# EAGLE design relay_shield2 (EAGLE 7.7.0)
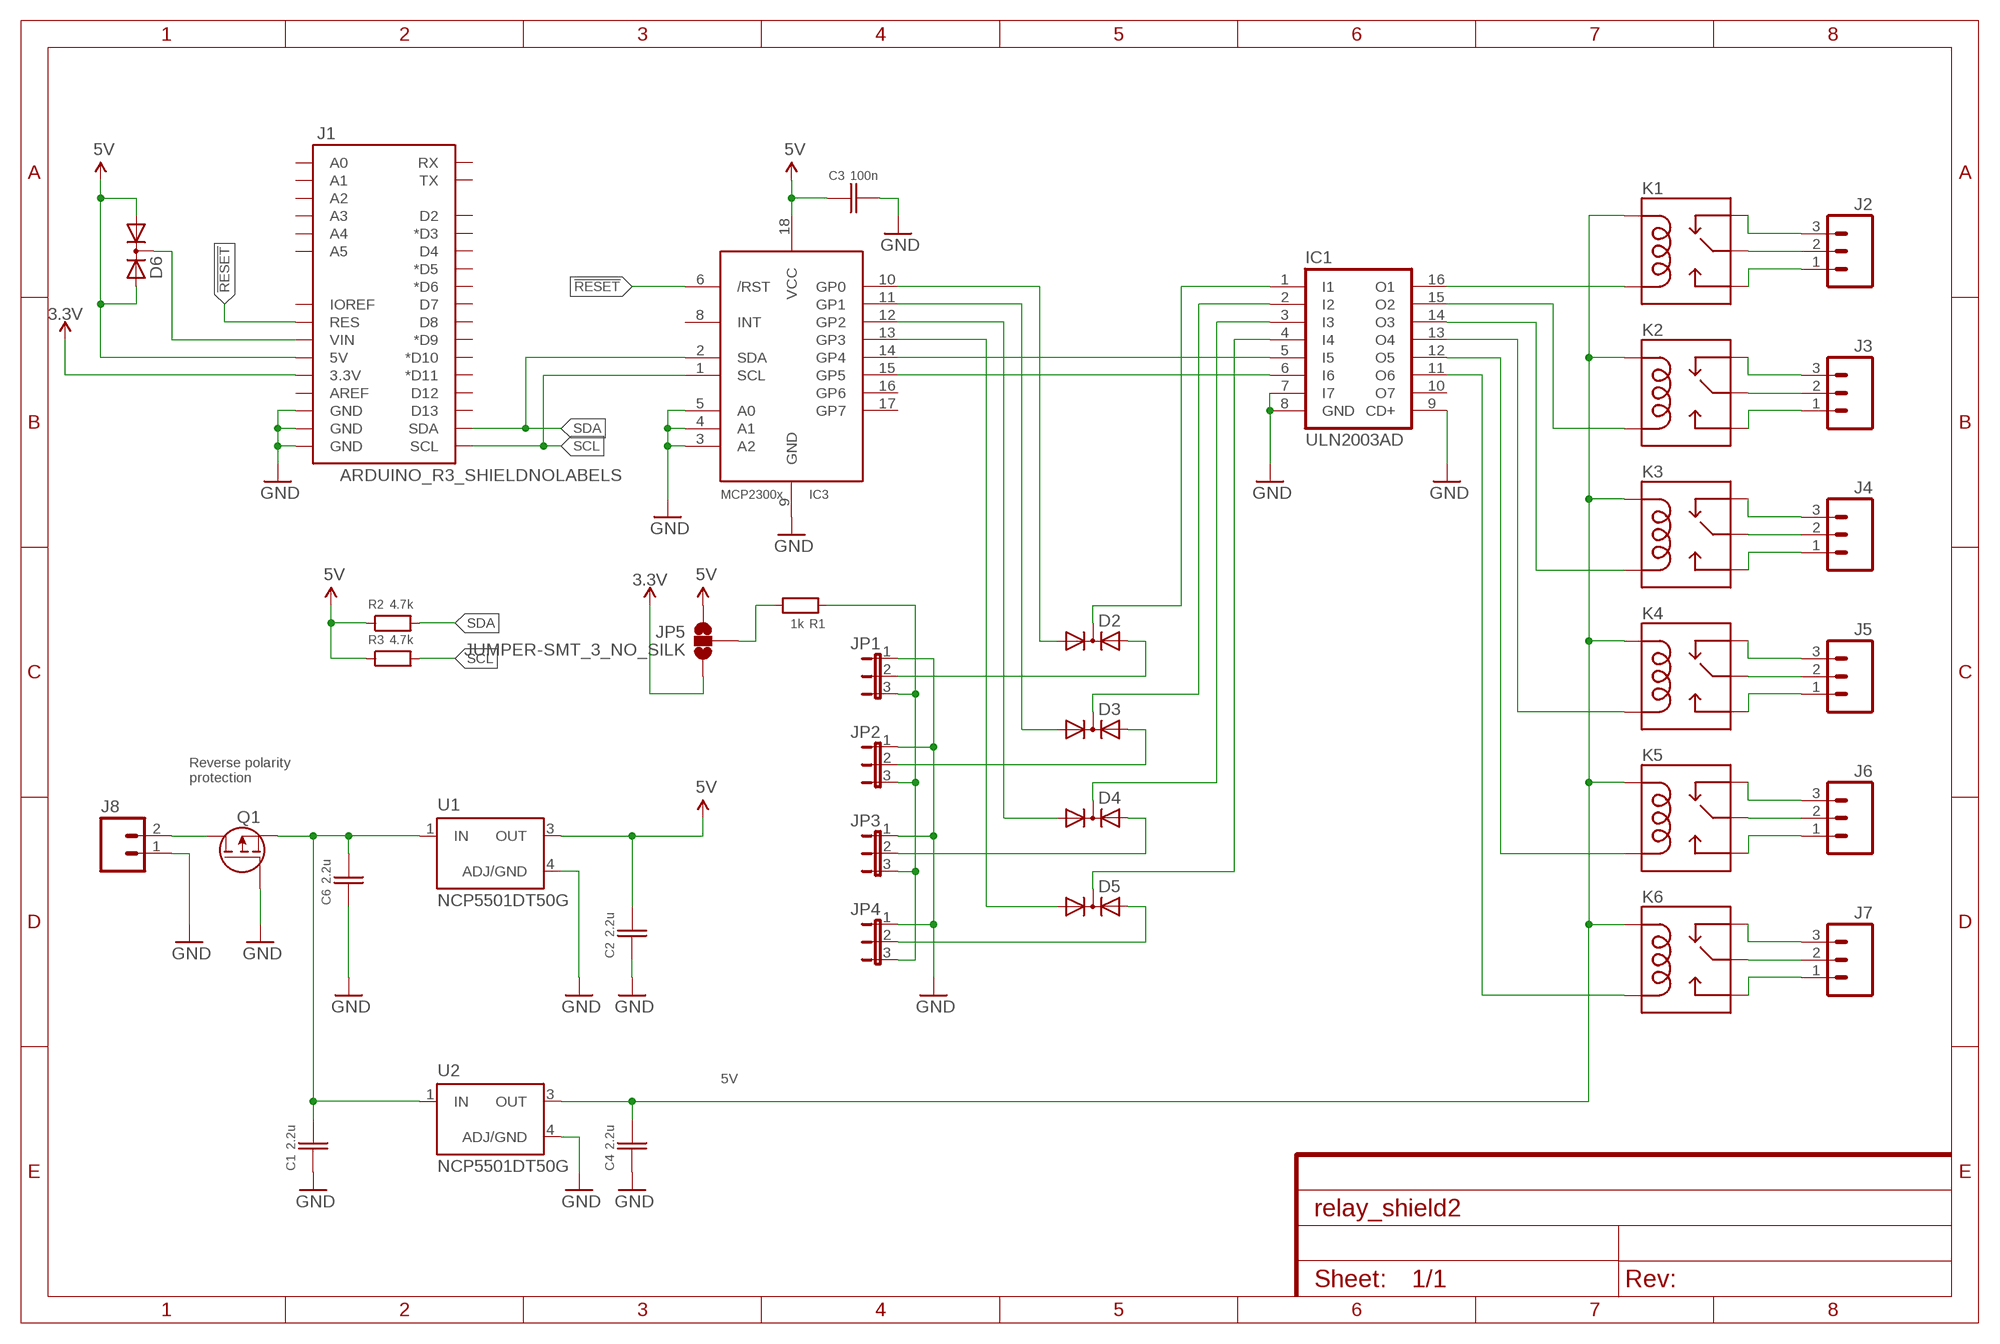
[diagram p0: schematic, sheet 1]

## Parts
C1  2.2u  CAPACITOR_NPOL-1206  [C1206]
C2  2.2u  CAPACITOR_NPOL-1206  [C1206]
C3  100n  CAPACITOR_NPOL-0603  [C603]
C4  2.2u  CAPACITOR_NPOL-1206  [C1206]
C6  2.2u  CAPACITOR_NPOL-1206  [C1206]
D2  DIODE-2AC|CASOT23  [SOT23]
D3  DIODE-2AC|CASOT23  [SOT23]
D4  DIODE-2AC|CASOT23  [SOT23]
D5  DIODE-2AC|CASOT23  [SOT23]
D6  DIODE-2AC|CASOT23  [SOT23]
IC1  ULN2003AD  [SO16]
IC3  MCP23008/SO  [SO18W]
J1  ARDUINO_R3_SHIELDNOLABELS  [UNO_R3_SHIELD_NOLABELS]
J2  M03SCREW  [SCREWTERMINAL-3.5MM-3]
J3  M03SCREW  [SCREWTERMINAL-3.5MM-3]
J4  M03SCREW  [SCREWTERMINAL-3.5MM-3]
J5  M03SCREW  [SCREWTERMINAL-3.5MM-3]
J6  M03SCREW  [SCREWTERMINAL-3.5MM-3]
J7  M03SCREW  [SCREWTERMINAL-3.5MM-3]
J8  M023.5MM  [SCREWTERMINAL-3.5MM-2]
JP1  JP2E  [JP2]
JP2  JP2E  [JP2]
JP3  JP2E  [JP2]
JP4  JP2E  [JP2]
JP5  JUMPER-SMT_3_NO_SILK  [SMT-JUMPER_3_NO_SILK]
K1  RELAY-SPDTPTH6  [RELAY-SCHRACK-RY211]
K2  RELAY-SPDTPTH6  [RELAY-SCHRACK-RY211]
K3  RELAY-SPDTPTH6  [RELAY-SCHRACK-RY211]
K4  RELAY-SPDTPTH6  [RELAY-SCHRACK-RY211]
K5  RELAY-SPDTPTH6  [RELAY-SCHRACK-RY211]
K6  RELAY-SPDTPTH6  [RELAY-SCHRACK-RY211]
Q1  MOSFET-P-SOT23-3  [SOT23-3]
R1  1k  RESISTOR-0603  [R0603]
R2  4.7k  RESISTOR-0603  [R0603]
R3  4.7k  RESISTOR-0603  [R0603]
U1  NCP5501DT50G  VREG-3PIN-DPAK  [DPAK]
U2  NCP5501DT50G  VREG-3PIN-DPAK  [DPAK]

## Nets
3.3V: J1.3.3V JP5.3
5V: C2.2 C3.1 D6.1(A1) D6.2(A2) IC3.18(VCC) J1.5V JP5.1 R2.1 R3.1 U1.3(OUT)
!RESET: IC3.6(/RST) J1.RES
GND: C1.1 C2.1 C3.2 C4.1 C6.1 IC1.7(I7) IC1.8(GND) IC1.9(CD+) IC3.3(A2) IC3.4(A1) IC3.5(A0) IC3.9(GND) J1.GND@0(GND) J1.GND@1(GND) J1.GND@2(GND) J8.1 JP1.1 JP2.1 JP3.1 JP4.1 Q1.1(G) U2.4(ADJ/GND)
N$1: D2.2(A2) JP1.2
N$2: D3.2(A2) JP2.2
N$3: J2.2 K1.11(MAIN)
N$4: C1.2 C6.2 Q1.2(S) U1.1(IN) U2.1(IN)
N$6: C4.2 K1.A1(COIL1) K2.A1(COIL1) K3.A1(COIL1) K4.A1(COIL1) K5.A1(COIL1) K6.A1(COIL1) U2.3(OUT)
N$7: J3.2 K2.11(MAIN)
N$8: J4.2 K3.11(MAIN)
N$9: J5.2 K4.11(MAIN)
N$10: J6.2 K5.11(MAIN)
N$11: J7.2 K6.11(MAIN)
N$12: IC1.16(O1) K1.A2(COIL2)
N$13: IC1.15(O2) K2.A2(COIL2)
N$14: IC1.14(O3) K3.A2(COIL2)
N$15: IC1.13(O4) K4.A2(COIL2)
N$16: IC1.12(O5) K5.A2(COIL2)
N$17: IC1.11(O6) K6.A2(COIL2)
N$18: D2.3(C) IC1.1(I1)
N$19: D3.3(C) IC1.2(I2)
N$20: D4.3(C) IC1.3(I3)
N$21: D5.3(C) IC1.4(I4)
N$22: IC1.5(I5) IC3.14(GP4)
N$23: IC1.6(I6) IC3.15(GP5)
N$24: D6.3(C) J1.VIN
N$25: D4.2(A2) JP3.2
N$26: D5.2(A2) JP4.2
N$27: D2.1(A1) IC3.10(GP0)
N$28: D3.1(A1) IC3.11(GP1)
N$29: D4.1(A1) IC3.12(GP2)
N$30: D5.1(A1) IC3.13(GP3)
N$31: J8.2 Q1.3(D)
N$32: J2.3 K1.12(NC)
N$33: J2.1 K1.14(NO)
N$34: J3.3 K2.12(NC)
N$35: J3.1 K2.14(NO)
N$36: J4.3 K3.12(NC)
N$37: J4.1 K3.14(NO)
N$38: J5.3 K4.12(NC)
N$39: J5.1 K4.14(NO)
N$40: J6.3 K5.12(NC)
N$41: J6.1 K5.14(NO)
N$42: J7.3 K6.12(NC)
N$43: J7.1 K6.14(NO)
N$44: JP1.3 JP2.3 JP3.3 JP4.3 R1.1
N$47: JP5.2 R1.2
SCL: IC3.1(SCL) J1.SCL R3.2
SDA: IC3.2(SDA) J1.SDA R2.2
Unconnected: IC1.10(O7) IC3.8(INT) IC3.16(GP6) IC3.17(GP7) J1.A0 J1.A1 J1.A2 J1.A3 J1.A4 J1.A5 J1.AREF J1.D2 J1.D3(*D3) J1.D4 J1.D5(*D5) J1.D6(*D6) J1.D7 J1.D8 J1.D9(*D9) J1.D10(*D10) J1.D11(*D11) J1.D12 J1.D13 J1.IOREF J1.RX J1.TX U1.4(ADJ/GND)

## Notes on the sheet
- Reverse polarity
  protection
- 5V

## Library data of the parts
C1-C4 C6 = kg-generic:CAPACITOR_NPOL: Non-Polarized capacitor in various packages
D2-D6 = diode:DIODE-2AC|CA: Dual DIODE Anode-Cathode|Cathode-Anode
IC1 = uln-udn:ULN2003A: DRIVER ARRAY
IC3 = adafruit:MCP23008: MCP23008 Inexpensive i2c i/o expander - 8 general purpose i/o pins with optional pullups
J1 = SparkFun-Boards:ARDUINO_R3_SHIELD: Shield form compatible with the Arduino Uno R3.
J2-J7 = SparkFun-Connectors:M03: Header 3 Standard 3-pin 0.1" header. Use with straight break away headers (SKU : PRT-00116), right angle break away headers (PRT-00553), swiss pins (PRT-00743), machine pins (PRT-00117), and female headers (PRT-00115). Molex polarized connector foot print use with SKU : PRT-08232 with associated crimp pins and housings.; PROD_ID: CONN-08288
J8 = SparkFun-Connectors:M02: Standard 2-pin 0.1" header. Use with - straight break away headers ( PRT-00116) - right angle break away headers (PRT-00553) - swiss pins (PRT-00743) - machine pins (PRT-00117) - female headers (PRT-00115) Molex polarized connector foot print use with: PRT-08233 with associated crimp pins and housings. 2.54_SCREWTERM for use with PRT-10571. 3.5mm Screw Terminal footprints for PRT-08084 5mm Screw Terminal footprints for use with PRT-08432; PROD_ID: CONN-08399
JP1-JP4 = jumper:JP2E: JUMPER
JP5 = SparkFun-Jumpers:JUMPER-SMT_3_NO: Normally open jumper This jumper has three pads in close proximity to each other. Apply solder to close the connection(s).
K1-K6 = kg-relays:RELAY-SPDT: SPDT relay (COM-00101)
Q1 = kg-generic:MOSFET-P: Generic P-MOSFET IRF7406 SO8 30V 5.8A 45mOhm IRLML6401 SOT23-3 12V 4.3A 50mOhm IRLML6402 SOT23-3 20V 3.7A 65mOhm
R1-R3 = kg-generic:RESISTOR: Generic resistor
U1 U2 = kg-generic:VREG-3PIN: Generic 3-pin linear voltage regulator

## Board
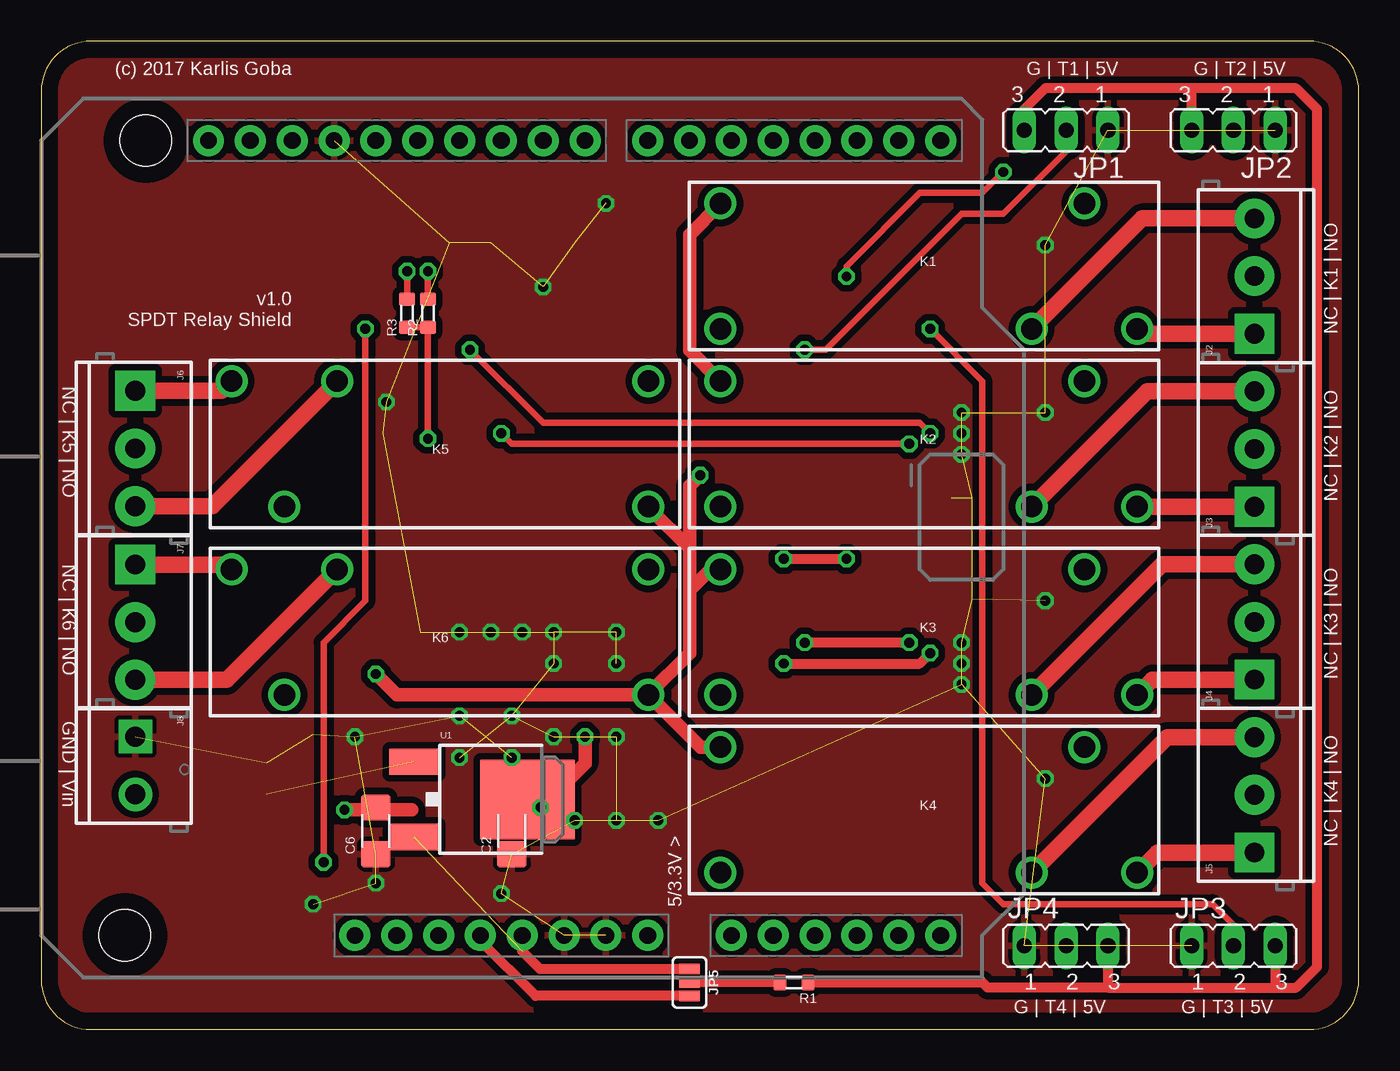
[diagram p1: board, top side]
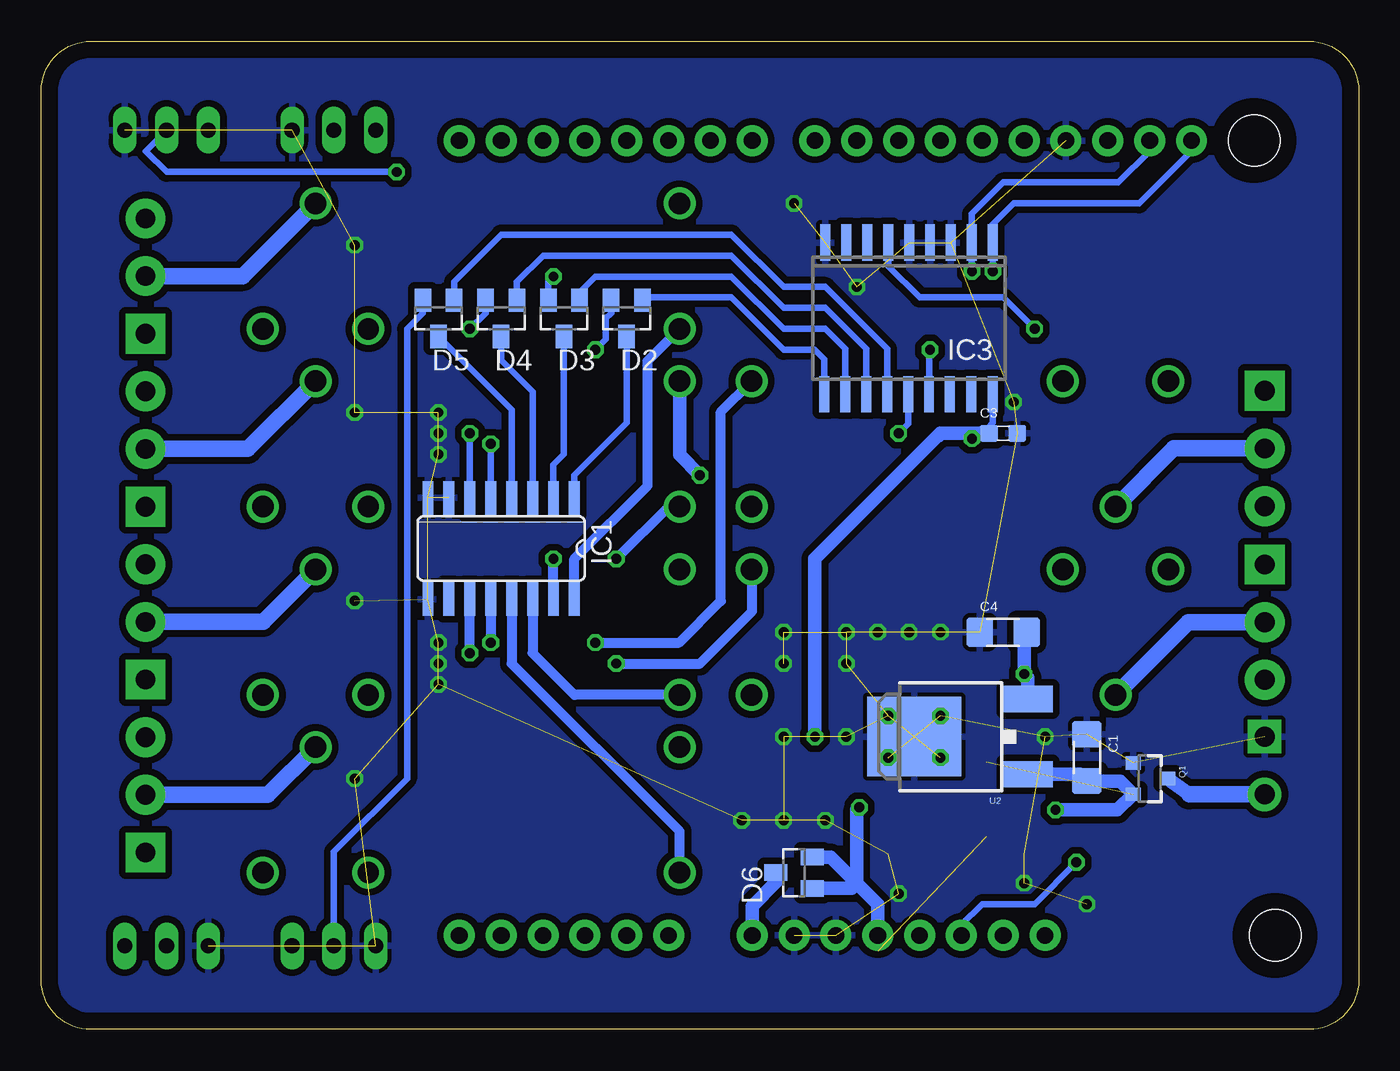
[diagram p2: board, bottom side, seen from below]

Size 80 x 60 mm. Coordinates in mm from the lower left corner, seen from the top.
Outline: 0,57 0,3 arc90 3,0 77,0 arc90 80,3 80,57 arc90 77,60 3,60 arc90 0,57
Copper layers (1*16): Top 0.035mm / dielectric 1.5mm / Bottom 0.035mm
Design rules "default": minimum track width 10mil, minimum drill 24mil, track to track 8mil, track to pad 8mil, pad to pad 8mil, via to via 8mil, smd to smd 8mil, copper to edge 40mil, drill to drill 8mil, minimum pad ring 10mil, minimum via ring 8mil, stop-mask expansion 4mil, vias tented up to drill 0mil, thermal gap 10mil
Holes 3.1 mm at 5.08,5.71 6.35,53.98

### Footprints (pad centres in the part's own frame; a part is rotated, then mirrored left to right if it is on the bottom)
C1206 = smd 1.6 x 1.803: 1 -1.422,0; 2 1.422,0
C603 = smd 1.1 x 1: 1 -0.85,0; 2 0.85,0
SOT23 = smd 1 x 1.4: 1 -0.95,-1.1; 2 0.95,-1.1; 3 0,1.1
SO16 = smd 0.66 x 2.032: 1 -4.445,-3.073; 2 -3.175,-3.073; 3 -1.905,-3.073; 4 -0.635,-3.073; 5 0.635,-3.073; 6 1.905,-3.073; 7 3.175,-3.073; 8 4.445,-3.073; 9 4.445,3.073; 10 3.175,3.073; 11 1.905,3.073; 12 0.635,3.073; 13 -0.635,3.073; 14 -1.905,3.073; 15 -3.175,3.073; 16 -4.445,3.073
SO18W = smd 0.6 x 2.2: 1 -4.445,-4.6; 2 -3.175,-4.6; 3 -1.905,-4.6; 4 -0.635,-4.6; 5 0.635,-4.6; 6 1.905,-4.6; 7 3.175,-4.6; 8 4.445,-4.6; 9 5.715,-4.6; 10 5.775,4.6; 11 4.505,4.6; 12 3.235,4.6; 13 1.965,4.6; 14 0.695,4.6; 15 -0.575,4.6; 16 -1.845,4.6; 17 -3.145,4.6; 18 -4.445,4.6
UNO_R3_SHIELD_NOLABELS = drill 1.016 pad 1.88: 3.3V 50.8,26.67; 5V 50.8,29.21; A0 50.8,41.91; A1 50.8,44.45; A2 50.8,46.99; A3 50.8,49.53; A4 50.8,52.07; A5 50.8,54.61; AREF 2.54,15.24; D2 2.54,49.53; D3 2.54,46.99; D4 2.54,44.45; D5 2.54,41.91; D6 2.54,39.37; D7 2.54,36.83; D8 2.54,33.02; D9 2.54,30.48; D10 2.54,27.94; D11 2.54,25.4; D12 2.54,22.86; D13 2.54,20.32; GND@0 50.8,31.75; GND@1 50.8,34.29; GND@2 2.54,17.78; IOREF 50.8,21.59; NC 50.8,19.05; RES 50.8,24.13; RX 2.54,54.61; SCL 2.54,10.16; SDA 2.54,12.7; TX 2.54,52.07; VIN 50.8,36.83
SCREWTERMINAL-3.5MM-3 = drill 1.2 pad 2.413 square: 1 0,0 | drill 1.2 pad 2.413: 2 3.5,0; 3 7,0
SCREWTERMINAL-3.5MM-2 = drill 1.2 pad 2.032 square: 1 0,0 | drill 1.2 pad 2.032: 2 3.5,0
JP2 = drill 0.914 long: 1 -2.54,0; 2 0,0; 3 2.54,0
SMT-JUMPER_3_NO_SILK = smd 0.635 x 1.27: 1 -0.813,0; 2 0,0; 3 0.813,0
RELAY-SCHRACK-RY211 = drill 1.3: 11 10,3.81; 12 6.8,-3.81; 14 13.2,-3.81; A1 -12.1,3.81; A2 -12.1,-3.81
SOT23-3 = smd 0.8 x 0.9: 1 -0.95,-1; 2 0.95,-1; 3 0,1.1
R0603 = smd 0.8 x 0.95: 1 -0.85,0; 2 0.85,0
DPAK = smd 1.6 x 3: 1 -2.28,-5.31; 3 2.28,-5.31 | smd 4.826 x 5.715: 4 0,1.588

### Placement (x,y rotation side)
C1  16.51,16.5 270 bottom
C2  28.57,12.05 90 top
C3  21.59,36.19 0 bottom
C4  21.59,24.12 0 bottom
C6  20.32,12.05 90 top
D2  44.45,43.17 180 bottom
D3  48.26,43.17 180 bottom
D4  52.07,43.17 180 bottom
D5  55.88,43.17 180 bottom
D6  34.29,9.52 90 bottom
IC1  52.07,29.2 180 bottom
IC3  26.67,43.17 180 bottom
J1  0,56.51 270 top
J2  73.66,42.24 90 top
J3  73.66,31.74 90 top
J4  73.66,21.24 90 top
J5  73.66,10.74 90 top
J6  5.71,38.77 270 top
J7  5.71,28.23 270 top
J8  5.71,17.77 270 top
JP1  62.23,54.6 180 top
JP2  72.39,54.6 180 top
JP3  72.39,5.07 0 top
JP4  62.23,5.07 0 top
JP5  39.36,2.85 270 top
K1  53.34,46.34 0 top
K2  53.34,35.55 0 top
K3  53.34,24.12 0 top
K4  53.34,13.32 0 top
K5  24.77,35.55 180 top
K6  24.77,24.12 180 top
Q1  12.7,15.23 270 bottom
R1  45.71,2.85 180 top
R2  23.48,43.49 90 top
R3  22.21,43.49 90 top
U1  27.94,13.97 270 top
U2  25.4,17.77 90 bottom

### Tracks (layer width: path | path; a pad name or v marks a point on that pad's centre or on a via)
3.3V  (via drill 0.6)
  Top 0.61: JP5.3 30.01,2.04 26.66,5.39 v26.66,5.7
  Bottom 0.406: v26.66,5.7 J1.3.3V
5V  (via drill 0.6)  (1 unrouted)
  Top 0.406: v23.48,35.87 R2.1 R3.1
  Top 0.61: 28.41,13.01 C2.2 | JP5.1 30.29,3.66 29.2,4.75 v29.2,5.7
  Top 0.813: v33.02,17.77 33.02,16.17 v30.33,13.48 C2.2
  Bottom 0.406: IC3.18 22.23,36.82 22.54,36.5 | 22.54,36.5 22.86,36.19 23.17,36.19 v23.48,35.87 | C3.1 22.44,36.4 22.54,36.5 | 25.4,36.19 25.4,35.88 25.39,35.87 | v29.2,5.7 J1.5V
  Bottom 0.813: 22.86,36.19 25.4,36.19 33.02,28.57 v33.02,17.77 | J1.5V 29.21,7.61 30.48,8.88 | 30.48,8.88 30.48,13.32 v30.33,13.48 | D6.1 30.8,8.56 30.48,8.88 | D6.2 32.06,10.46 30.48,8.88
!RESET  (via drill 0.6)
  Top 0.406: v19.68,42.53 19.68,26.02 17.14,23.48 v17.14,10.15
  Bottom 0.406: IC3.6 28.57,46.34 26.67,44.44 21.59,44.44 v19.68,42.53 | v17.14,10.15 19.68,7.61 22.86,7.61 24.13,6.34 J1.RES
GND  (via drill 0.6)  (54 unrouted)
  other vias: 20.32,8.88 32.38,12.69 27.94,8.24 19.05,17.77 25.4,24.12 31.11,17.77 31.11,24.12 29.21,24.12 31.11,22.21 27.3,24.12 30.48,45.08 20.95,38.09 55.88,23.48 55.88,34.91 60.96,15.23 60.96,26.02 60.96,37.45 60.96,47.62 34.29,50.16 16.51,7.61 55.88,36.19 55.88,22.21 55.88,20.95 55.88,37.45 28.57,16.5 28.57,19.04 25.4,19.04 25.4,16.5 34.92,12.69 37.47,12.69 34.92,22.21 34.92,24.12 34.92,17.77
  pour Bottom (isolate 0.406): 82.55,63.3 82.55,-3.17 -2.54,-3.17 -2.54,63.3
  pour Top (isolate 0.406): 83.82,64.57 83.82,-4.44 -3.81,-4.44 -3.81,64.57
N$1  (via drill 0.6)
  Top 0.406: v46.35,41.27 47.62,41.27 55.88,49.52 58.42,49.52 62.23,53.33 JP1.2
  Bottom 0.406: D2.2 45.4,43.49 45.72,43.17 45.72,41.9 v46.35,41.27
N$2  (via drill 0.6)
  Top 0.406: v48.9,45.71 48.9,46.34 53.34,50.79 57.15,50.79 v58.42,52.06
  Bottom 0.406: D3.2 49.21,45.4 v48.9,45.71 | v58.42,52.06 72.39,52.06 73.66,53.33 JP2.2
N$3
  Bottom 1.016: J2.2 67.75,45.74 K1.11
N$4  (via drill 0.6)  (1 unrouted)
  Top 0.61: C6.2 20.32,13.32
  Top 0.813: v18.41,13.32 20.32,13.32 22.5,13.32
  Bottom 0.813: v18.41,13.32 14.65,13.32 Q1.2 14.5,15.08 C1.2 16.92,15.49 U2.1
  Bottom 1.27: 16.59,15 C1.2
N$6  (via drill 0.6)
  Top 0.406: K1.A1 41.24,50.12 | K5.A1 36.87,31.7 | K6.A1 36.87,20.34
  Top 0.813: 41.24,50.12 39.37,48.25 39.37,41.23 K2.A1 | 39.37,29.2 39.37,26.66 | 36.87,31.7 39.37,29.2 | K3.A1 40.64,27.93 39.37,26.66 | 36.87,20.34 39.37,22.85 39.37,26.66 | K4.A1 40.04,17.14 K6.A1 21.59,20.31 v20.32,21.58 | 39.37,29.2 39.37,33.01 v40.01,33.65
  Bottom 0.406: 20.09,21.35 v20.32,21.58 | 20.32,23.97 C4.2
  Bottom 0.813: K2.A1 41.24,34.88 v40.01,33.65 | U2.3 20.09,21.35 | v20.32,21.58 20.32,23.97
N$7
  Bottom 1.016: J3.2 67.46,35.24 K2.11
N$8
  Bottom 1.016: J4.2 66.53,24.74 K3.11
N$9
  Bottom 1.016: J5.2 66.23,14.24 K4.11
N$10
  Bottom 1.016: J6.2 11.23,35.27 K5.11
N$11
  Bottom 1.016: J7.2 10.35,24.73 K6.11
N$12
  Bottom 0.61: IC1.16 47.62,28.57 43.18,33.01 43.18,40.59 K1.A2
N$13  (via drill 0.6)
  Top 0.61: v45.09,28.57 v48.9,28.57
  Bottom 0.61: IC1.15 v48.9,28.57 | K2.A2 41.91,31.74 v45.09,28.57
N$14
  Bottom 0.61: IC1.14 50.16,22.85 47.62,20.31 K3.A2
N$15
  Bottom 0.61: IC1.13 51.44,22.21 41.24,12.02 K4.A2
N$16  (via drill 0.6)
  Top 0.61: v52.7,23.48 v46.35,23.48
  Bottom 0.61: IC1.12 v52.7,23.48 | K5.A2 38.73,37.49 38.73,26.02 41.27,23.48 v46.35,23.48
N$17  (via drill 0.6)
  Top 0.61: v45.09,22.21 53.34,22.21 v53.98,22.85
  Bottom 0.406: 36.83,27.89 K6.A2
  Bottom 0.61: v53.98,22.85 IC1.11 | v45.09,22.21 40.01,22.21 36.83,25.39 36.83,27.89
N$18
  Bottom 0.406: IC1.1 47.62,33.65 44.45,36.82 D2.3
N$19
  Bottom 0.406: D3.3 48.26,34.91 48.9,34.28 IC1.2
N$20
  Bottom 0.406: IC1.3 50.16,38.73 52.07,40.63 D4.3
N$21
  Bottom 0.406: IC1.4 51.44,37.62 D5.3
N$22  (via drill 0.6)
  Top 0.406: v52.7,35.55 28.57,35.55 v27.94,36.19
  Bottom 0.406: 52.7,33.01 IC1.5 v52.7,35.55 | IC3.14 27.36,36.76 v27.94,36.19
N$23  (via drill 0.6)
  Top 0.406: v53.98,36.19 53.34,36.82 30.48,36.82 v26.04,41.27
  Bottom 0.406: IC1.6 v53.98,36.19 | IC3.15 26.09,41.2 v26.04,41.27
N$24
  Bottom 0.813: J1.VIN 36.83,7.49 35.39,8.93 D6.3
N$25  (via drill 0.6)
  Top 0.406: v53.98,42.53 57.15,39.36 57.15,8.88 58.42,7.61 71.12,7.61 72.39,6.34 JP3.2
  Bottom 0.406: D4.2 53.02,43.49 v53.98,42.53
N$26
  Bottom 0.406: D5.2 56.83,43.49 57.78,42.53 57.78,15.23 62.23,10.79 JP4.2
N$27
  Bottom 0.406: IC3.10 32.45,40.69 33.02,41.27 34.92,41.27 38.1,44.44 43.33,44.44 D2.1
N$28
  Bottom 0.406: IC3.11 31.18,41.33 32.38,42.53 34.92,42.53 38.1,45.71 46.35,45.71 47.31,44.76 D3.1
N$29
  Bottom 0.406: IC3.12 29.91,41.33 32.38,43.8 34.92,43.8 38.1,46.98 49.53,46.98 51.12,45.39 D4.1
N$30
  Bottom 0.406: IC3.13 28.64,41.33 32.38,45.08 34.92,45.08 38.1,48.25 52.07,48.25 54.93,45.39 D5.1
N$31
  Bottom 0.813: 10.3,14.27 Q1.3
  Bottom 1.016: J8.2 10.3,14.27
N$32
  Top 1.016: J2.3 66.84,49.24 K1.12
N$33
  Top 1.016: J2.1 66.83,42.24 K1.14
N$34
  Top 1.016: J3.3 67.14,38.74 K2.12
N$35
  Top 1.016: J3.1 K2.14
N$36
  Top 1.016: J4.3 68.07,28.24 K3.12
N$37
  Top 1.016: J4.1 67.47,21.24 K3.14
N$38
  Top 1.016: J5.3 68.36,17.74 K4.12
N$39
  Top 1.016: J5.1 67.77,10.74 K4.14
N$40
  Top 1.016: J6.3 10.38,31.77 K5.12
N$41
  Top 1.016: J6.1 10.97,38.77 K5.14
N$42
  Top 1.016: J7.3 11.26,21.23 K6.12
N$43
  Top 1.016: J7.1 11.27,28.23 K6.14
N$44
  Top 0.61: 64.77,2.53 74.93,2.53 | 74.93,2.53 76.2,2.53 77.47,3.8 77.47,55.87 76.2,57.14 69.85,57.14 | 69.85,57.14 60.96,57.14 59.69,55.87 JP1.3 | JP2.3 69.85,57.14 | JP3.3 74.93,2.53 | JP4.3 64.77,2.53 | R1.1 57.14,2.85 57.46,2.53 64.77,2.53
N$47
  Top 0.61: R1.2 JP5.2
SCL  (via drill 0.6)
  Top 0.406: v22.21,46.03 R3.2
  Bottom 0.406: J1.SCL 10.16,53.33 13.34,50.16 20.95,50.16 22.23,48.88 IC3.1 22.23,46.04 v22.21,46.03
SDA  (via drill 0.6)
  Top 0.406: v23.48,46.03 R2.2
  Bottom 0.406: J1.SDA 12.7,53.33 14.61,51.42 21.59,51.42 23.5,49.52 IC3.2 23.5,46.04 v23.48,46.03

### Text on the board
tPlace: (c) 2017 Karlis Goba | G | T1 | 5V | G | T2 | 5V | v1.0 | SPDT Relay Shield | NC | K1 | NO | NC | K5 | NO | NC | K2 | NO | NC | K6 | NO | NC | K3 | NO | GND | Vin | 5/3.3V > | NC | K4 | NO | G | T4 | 5V | G | T3 | 5V